# EAGLE schematic quad (EAGLE 7.5.0)
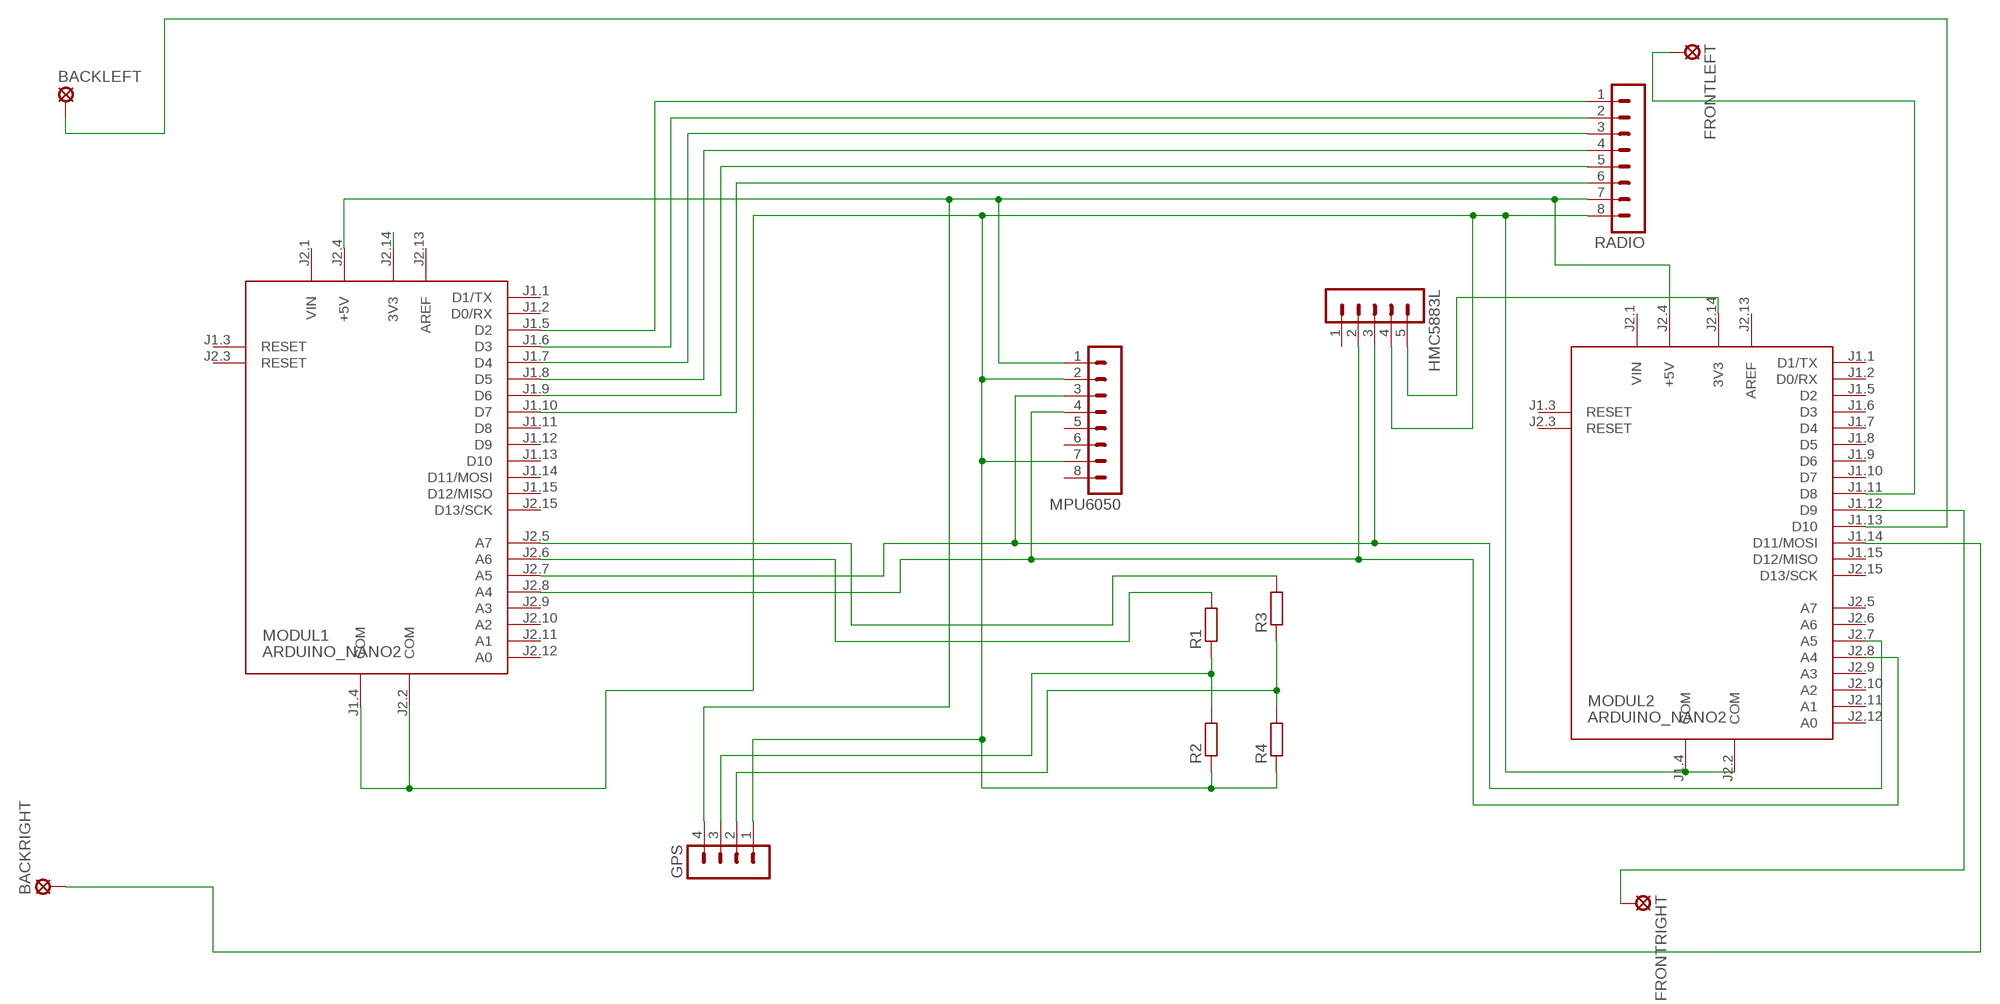
[diagram p0: schematic, sheet 1]

## Parts
BACKLEFT  LSP11  [LSP11]
BACKRIGHT  LSP11  [LSP11]
FRONTLEFT  LSP11  [LSP11]
FRONTRIGHT  LSP11  [LSP11]
GPS  MA04-1  [MA04-1]
HMC5883L  MA05-1  [MA05-1]
MODUL1  ARDUINO_NANO2  [ARDUINO_NANO2]
MODUL2  ARDUINO_NANO2  [ARDUINO_NANO2]
MPU6050  MA08-1  [MA08-1]
R1  R-EU_0207/10  [0207/10]
R2  R-EU_0207/10  [0207/10]
R3  R-EU_0207/10  [0207/10]
R4  R-EU_0207/10  [0207/10]
RADIO  MA08-1  [MA08-1]

## Nets
GND: GPS.1 HMC5883L.4 MODUL1.J1.4(COM) MODUL1.J2.2(COM) MODUL2.J1.4(COM) MODUL2.J2.2(COM) MPU6050.2 MPU6050.7 R2.1 R4.1 RADIO.8
N$1: FRONTLEFT.MP MODUL2.J1.11(D8)
N$3: BACKLEFT.MP MODUL2.J1.13(D10)
N$4: BACKRIGHT.MP MODUL2.J1.14(D11/MOSI)
N$5: MODUL1.J1.5(D2) RADIO.1
N$6: FRONTRIGHT.MP MODUL2.J1.12(D9)
N$7: MODUL1.J1.6(D3) RADIO.2
N$8: MODUL1.J1.7(D4) RADIO.3
N$10: MODUL1.J2.6(A6) R1.2
N$11: MODUL1.J1.8(D5) RADIO.4
N$12: MODUL1.J1.9(D6) RADIO.5
N$13: MODUL1.J1.10(D7) RADIO.6
N$14: HMC5883L.5 MODUL2.J2.14(3V3)
N$15: MODUL1.J2.14(3V3)
N$16: HMC5883L.3 MODUL1.J2.7(A5) MODUL2.J2.7(A5) MPU6050.3
N$17: HMC5883L.2 MODUL1.J2.8(A4) MODUL2.J2.8(A4) MPU6050.4
N$18: MODUL1.J2.5(A7) R3.2
N$20: GPS.3 R1.1 R2.2
N$21: GPS.2 R3.1 R4.2
VDD: GPS.4 MODUL1.J2.4(+5V) MODUL2.J2.4(+5V) MPU6050.1 RADIO.7
Unconnected: HMC5883L.1 MODUL1.J1.1(D1/TX) MODUL1.J1.2(D0/RX) MODUL1.J1.3(RESET) MODUL1.J1.11(D8) MODUL1.J1.12(D9) MODUL1.J1.13(D10) MODUL1.J1.14(D11/MOSI) MODUL1.J1.15(D12/MISO) MODUL1.J2.3(RESET) MODUL1.J2.9(A3) MODUL1.J2.10(A2) MODUL1.J2.11(A1) MODUL1.J2.12(A0) MODUL1.J2.15(D13/SCK) MODUL2.J1.1(D1/TX) MODUL2.J1.2(D0/RX) MODUL2.J1.3(RESET) MODUL2.J1.5(D2) MODUL2.J1.6(D3) MODUL2.J1.7(D4) MODUL2.J1.8(D5) MODUL2.J1.9(D6) MODUL2.J1.10(D7) MODUL2.J1.15(D12/MISO) MODUL2.J2.3(RESET) MODUL2.J2.5(A7) MODUL2.J2.6(A6) MODUL2.J2.9(A3) MODUL2.J2.10(A2) MODUL2.J2.11(A1) MODUL2.J2.12(A0) MODUL2.J2.15(D13/SCK) MPU6050.5 MPU6050.6 MPU6050.8

## Power pins joined to a net without a drawn wire
AREF: MODUL1.J2.13(AREF) MODUL2.J2.13(AREF)
VIN: MODUL1.J2.1(VIN) MODUL2.J2.1(VIN)

## Library data of the parts
BACKLEFT BACKRIGHT FRONTLEFT FRONTRIGHT = solpad:LSP11: SOLDER PAD drill 1.1 mm
GPS = con-lstb:MA04-1: PIN HEADER; OC_FARNELL: unknown; OC_NEWARK: unknown
HMC5883L = con-lstb:MA05-1: PIN HEADER; OC_FARNELL: unknown; OC_NEWARK: unknown
MODUL1 MODUL2 = arduino:ARDUINO_NANO2: Arduino Nano2 Auto generated by modulcreator.ulp \;; ANZAHL: 2; MODUL: TRUE; STECKX0: -76200; STECKX1: 76200; STECKY0: 177800; STECKY1: 177800
MPU6050 RADIO = con-lstb:MA08-1: PIN HEADER; OC_FARNELL: unknown; OC_NEWARK: unknown
R1-R4 = rcl:R-EU_: RESISTOR, European symbol